# Altium project HouseKeeper_V1.PrjPcb
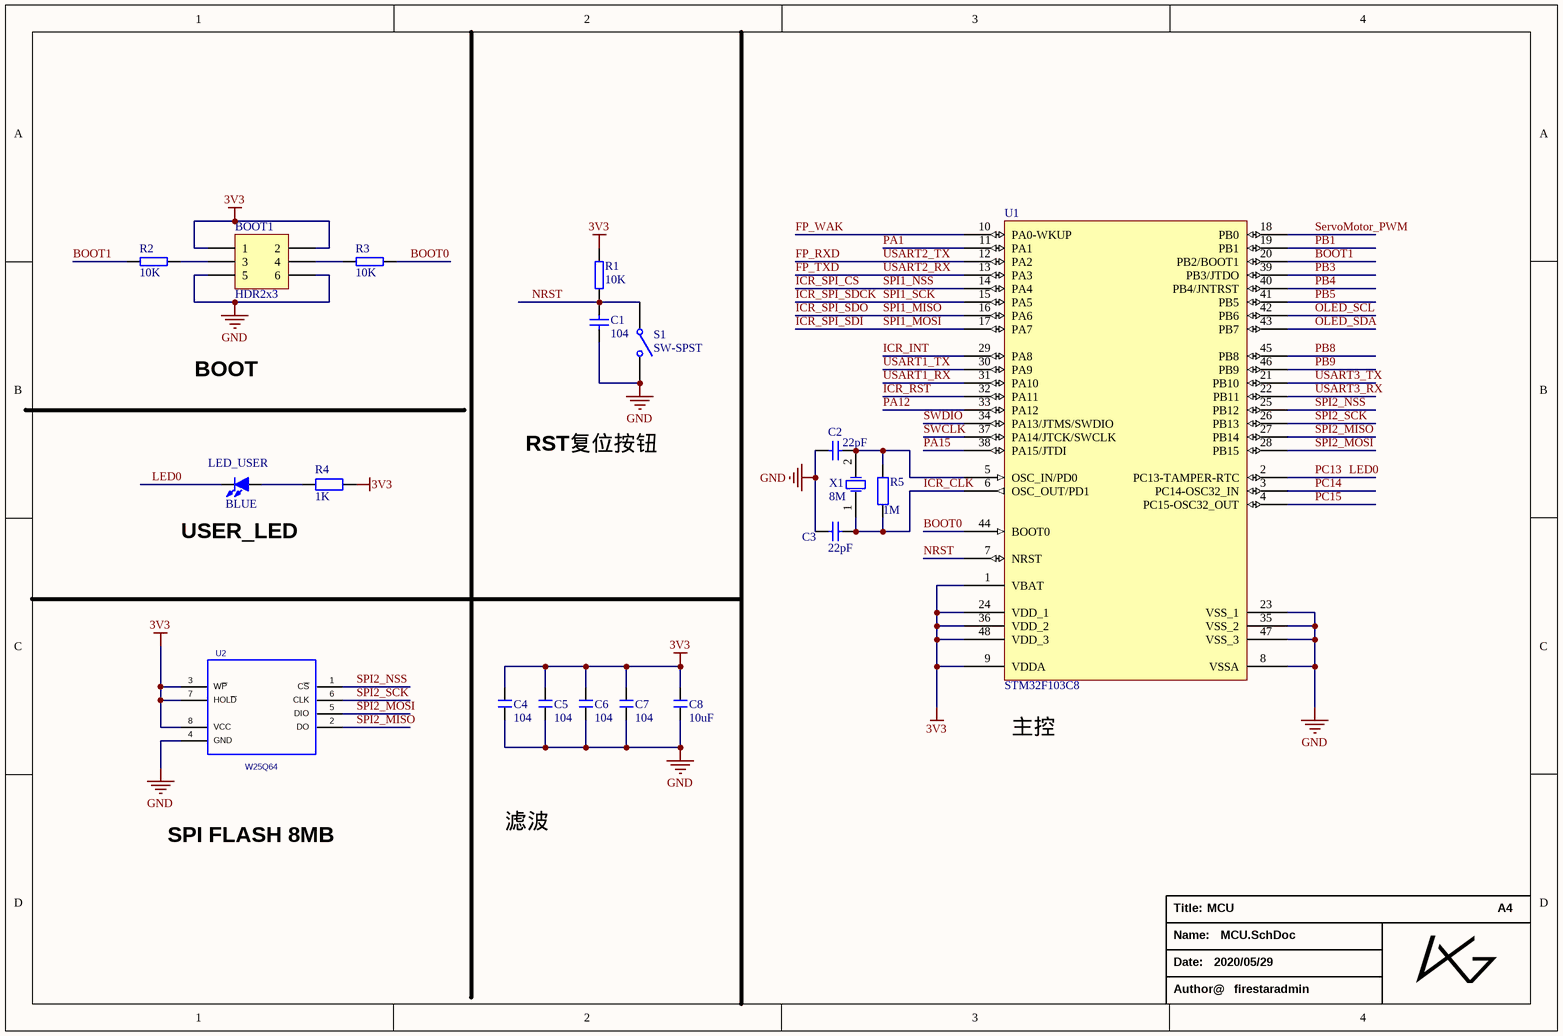
[diagram p0: MCU.SchDoc]
5 sheets, 83 parts. Net scope: global (net labels, ports and power ports of the same name join across sheets).
Board file: V1.PcbDoc
Sheets:
  MCU.SchDoc
  ESP8266EX.SchDoc
  POWER.SchDoc
  Voice.SchDoc
  interface.SchDoc

## Sheet MCU.SchDoc: MCU
size A4; Date: 2020/05/29; SheetNumber: 1

### Parts
BOOT1  HDR2x3  [HDR2.54-LI-2x3P]
C1  104  [C 0603_M]
C2  22pF  [C 0603_M]
C3  22pF  [C 0603_M]
C4  104  [C 0603_M]
C5  104  [C 0603_M]
C6  104  [C 0603_M]
C7  104  [C 0603_M]
C8  10uF  [C 0805_M]
LED_USER  BLUE  [LED 0603B]
R1  10K  [R 0603_M]
R2  10K  [R 0603_M]
R3  10K  [R 0603_M]
R4  1K  [R 0805_M]
R5  1M  [R 0603_M]
S1  SW-SPST  [TSW SMD-3*6*2.5]
U1  STM32F103C8  [LQFP48 7X7_M]
U2  W25Q64  [SOP8W_M]
X1  8M  [OSC 5032-2P]

### Nets
3V3: BOOT1.1 BOOT1.2 C4.2 C5.2 C6.2 C7.2 C8.2 R1.2 R4.2 U1.1(VBAT) U1.9(VDDA) U1.24(VDD_1) U1.36(VDD_2) U1.48(VDD_3) U2.3(W~{P}) U2.7(HOL~{D}) U2.8(VCC)
GND: BOOT1.5 BOOT1.6 C1.2 C2.2 C3.2 C4.1 C5.1 C6.1 C7.1 C8.1 S1.2(NO) U1.8(VSSA) U1.23(VSS_1) U1.35(VSS_2) U1.47(VSS_3) U2.4(GND)
BOOT0: R3.1 U1.44(BOOT0)
BOOT1: R2.2 U1.20(PB2/BOOT1)
FP_RXD: U1.12(PA2)  [also labelled USART2_TX]
FP_TXD: U1.13(PA3)  [also labelled USART2_RX]
FP_WAK: U1.10(PA0-WKUP)
ICR_CLK: C3.1 R5.1 U1.6(OSC_OUT/PD1) X1.1
ICR_INT: U1.29(PA8)
ICR_RST: U1.32(PA11)
ICR_SPI_CS: U1.14(PA4)  [also labelled SPI1_NSS]
ICR_SPI_SDCK: U1.15(PA5)  [also labelled SPI1_SCK]
ICR_SPI_SDI: U1.17(PA7)  [also labelled SPI1_MOSI]
ICR_SPI_SDO: U1.16(PA6)  [also labelled SPI1_MISO]
LED0: LED_USER.2(K) U1.2(PC13-TAMPER-RTC)  [also labelled PC13]
NRST: C1.1 R1.1 S1.1(COMMON) U1.7(NRST)
OLED_SCL: U1.42(PB6)
OLED_SDA: U1.43(PB7)
PA1: U1.11(PA1)
PA12: U1.33(PA12)
PA15: U1.38(PA15/JTDI)
PB1: U1.19(PB1)
PB3: U1.39(PB3/JTDO)
PB4: U1.40(PB4/JNTRST)
PB5: U1.41(PB5)
PB8: U1.45(PB8)
PB9: U1.46(PB9)
PC14: U1.3(PC14-OSC32_IN)
PC15: U1.4(PC15-OSC32_OUT)
ServoMotor_PWM: U1.18(PB0)
SPI2_MISO: U1.27(PB14) U2.2(DO)
SPI2_MOSI: U1.28(PB15) U2.5(DIO)
SPI2_NSS: U1.25(PB12) U2.1(C~{S})
SPI2_SCK: U1.26(PB13) U2.6(CLK)
SWCLK: U1.37(PA14/JTCK/SWCLK)
SWDIO: U1.34(PA13/JTMS/SWDIO)
USART1_RX: U1.31(PA10)
USART1_TX: U1.30(PA9)
USART3_RX: U1.22(PB11)
USART3_TX: U1.21(PB10)
NetBOOT1_3: BOOT1.3 R2.1
NetBOOT1_4: BOOT1.4 R3.2
NetC2_1: C2.1 R5.2 U1.5(OSC_IN/PD0) X1.2
NetLED_USER_1: LED_USER.1(A) R4.1

### Notes on the sheet
- BOOT
- RST复位按钮
- (near LED_USER) USER_LED
- (near U1) 主控
- SPI FLASH 8MB
- 滤波
- Title:
- A4
- Name:
- Date:
- Author@
- firestaradmin

### Library data of the parts
BOOT1 = HDR2x3: Connector
C1 = CAP1: Capacitor; Tolerate: 50V; Value: 100nF; TOL: 10%; ERP: 0103020075; PCB_Layout: Top Layer SMC; Revision: 2012-3-28; Publisher: ZL_A0OFFICE
C2 C3 = CAP1: Capacitor; Tolerate: 50V; Value: 20pF; TOL: 2%; ERP: 0103020090; PCB_Layout: Top Layer SMC; Revision: 2012-3-28; Publisher: ZL_A0OFFICE
C4-C8 = C: 无极性贴片电容; 版权归属: 源创客; BOM名称: 无极性贴片电容; 学习资源: www.ooocke.com
LED_USER = LED-SMD: 贴片LED; 版权归属: 源创客; BOM名称: 贴片LED; 学习资源: www.ooocke.com
R1-R3 = R
R4 R5 = R: 贴片电阻; 版权归属: 源创客; BOM名称: 贴片电阻; 学习资源: www.ooocke.com
S1 = SW-SPST: Single-Pole, Single-Throw Switch
U1 = STM32F103C8: Flaah:64/RAM:20/IO:36; BOM名称: 32位STM单片机; 版权归属: 源创客; 学习资源: www.ooocke.com
U2 = W25Q64: PCB DECAL: SO8WB
X1 = XTAL_SMD: Crystal Oscillator; ERP: 0103040021; Value: 8MHz; TOL: ±20ppm; Tolerate: ROSON -20_+70 20pf; PCB_Layout: Top Layer SMC; Publisher: ZL_A0OFFICE; Revision: 2012-3-28

## Sheet ESP8266EX.SchDoc
size A4; Date: 2020/05/29
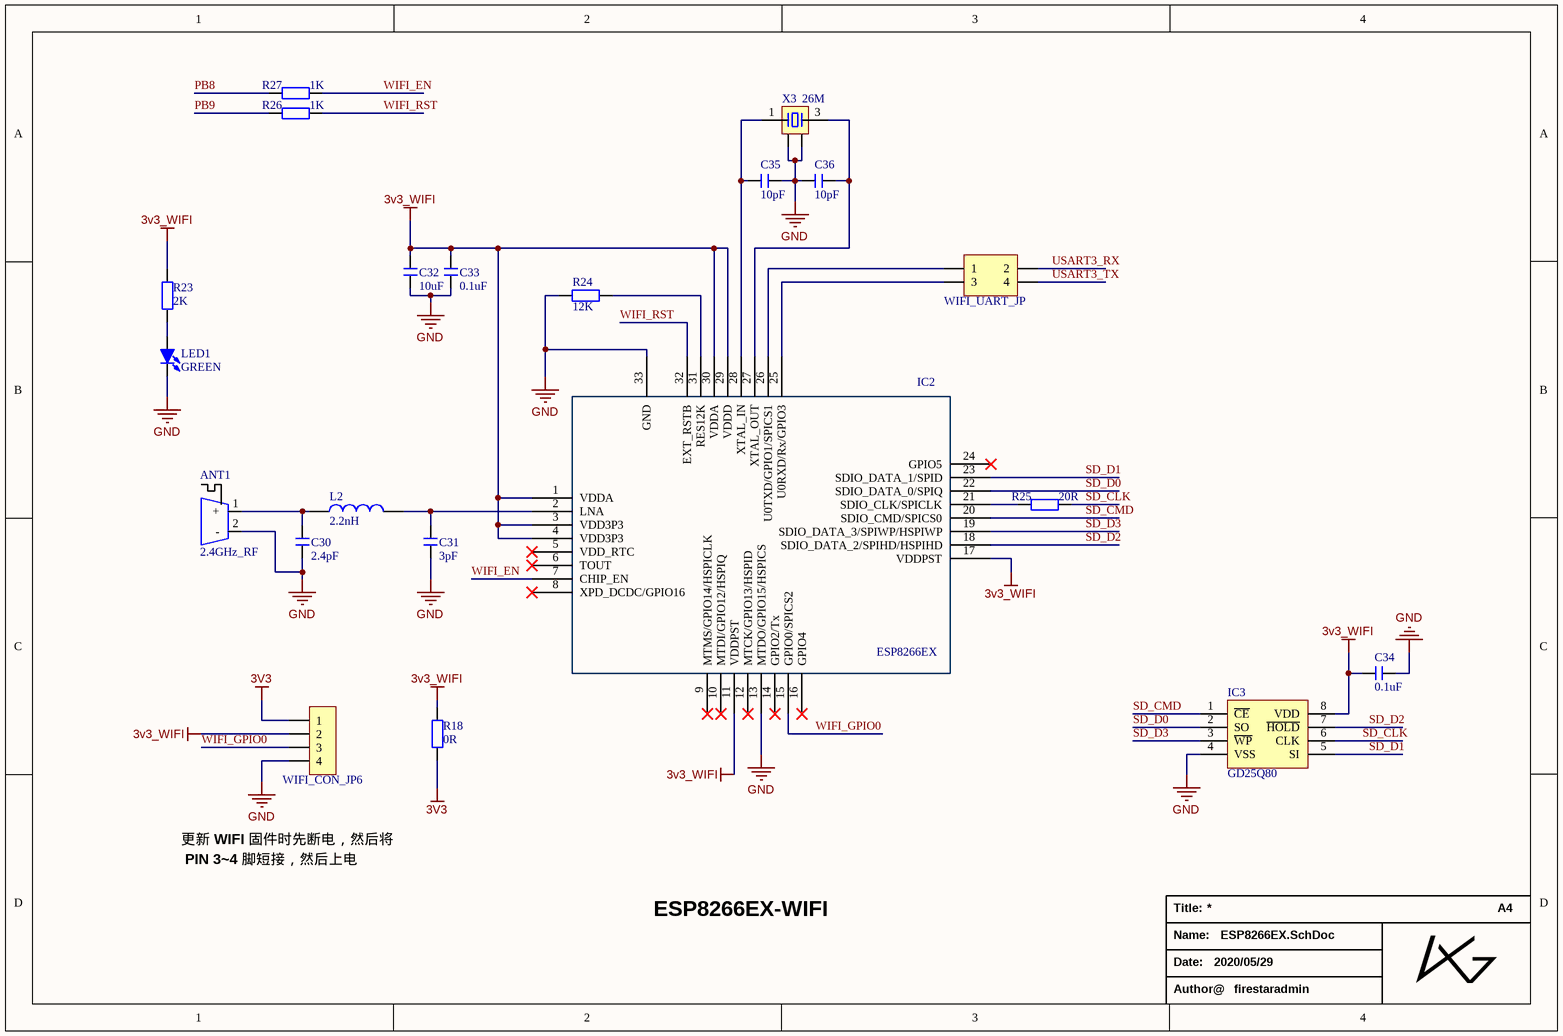
[diagram p1: ESP8266EX.SchDoc]

### Parts
ANT1  2.4GHz_RF  [ANT-F-1-2.4G]
C30  2.4pF  [C 0603_M]
C31  3pF  [C 0603_M]
C32  10uF  [C 0603_M]
C33  0.1uF  [C 0603_M]
C34  0.1uF  [C 0603_M]
C35  10pF  [C 0603_M]
C36  10pF  [C 0603_M]
IC2  ESP8266EX  [QFN32 5x5_M]
IC3  GD25Q80  [SOP8W_N]
L2  2.2nH  [L 0603]
LED1  GREEN  [LED 0603G]
R18  0R  [R 0603_M]
R23  2K  [R 0603_M]
R24  12K  [R 0603_M]
R25  20R  [R 0603_M]
R26  1K  [R 0603_M]
R27  1K  [R 0603_M]
WIFI_CON_JP6  HDR-1X4  [HDR2.54-LI-4P]  (value not drawn)
WIFI_UART_JP  Header2X2  [HDR2.54-LI-2x2P]  (value not drawn)
X3  26M  [OSC 3225-4P]

### Nets
3V3: R18.1 WIFI_CON_JP6.1
3v3_WIFI: C32.1 C33.1 C34.1 IC2.1(VDDA) IC2.3(VDD3P3) IC2.4(VDD3P3) IC2.11(VDDPST) IC2.17(VDDPST) IC2.29(VDDD) IC2.30(VDDA) IC3.8(VDD) R18.2 R23.2 WIFI_CON_JP6.2
GND: ANT1.2(-) C30.2 C31.2 C32.2 C33.2 C34.2 C35.1 C36.2 IC2.13(MTDO/GPIO15/HSPICS) IC2.33(GND) IC3.4(VSS) LED1.2(K) R24.2 WIFI_CON_JP6.4 X3.2 X3.4
PB8: R27.2
PB9: R26.2
SD_CLK: IC3.6(CLK) R25.1
SD_CMD: IC2.20(SDIO_CMD/SPICS0) IC3.1(~{CE})
SD_D0: IC2.22(SDIO_DATA_0/SPIQ) IC3.2(SO)
SD_D1: IC2.23(SDIO_DATA_1/SPID) IC3.5(SI)
SD_D2: IC2.18(SDIO_DATA_2/SPIHD/HSPIHD) IC3.7(~{HOLD})
SD_D3: IC2.19(SDIO_DATA_3/SPIWP/HSPIWP) IC3.3(~{WP})
USART3_RX: WIFI_UART_JP.2
USART3_TX: WIFI_UART_JP.4
WIFI_EN: IC2.7(CHIP_EN) R27.1
WIFI_GPIO0: IC2.15(GPIO0/SPICS2) WIFI_CON_JP6.3
WIFI_RST: IC2.32(EXT_RSTB) R26.1
NetANT1_1: ANT1.1(+) C30.1 L2.1
NetC31_1: C31.1 IC2.2(LNA) L2.2
NetC35_2: C35.2 IC2.28(XTAL_IN) X3.1
NetC36_1: C36.1 IC2.27(XTAL_OUT) X3.3
NetIC2_21: IC2.21(SDIO_CLK/SPICLK) R25.2
NetIC2_25: IC2.25(U0RXD/Rx/GPIO3) WIFI_UART_JP.3
NetIC2_26: IC2.26(U0TXD/GPIO1/SPICS1) WIFI_UART_JP.1
NetIC2_31: IC2.31(RES12K) R24.1
NetLED1_1: LED1.1(A) R23.1

Not connected (* = marked no-connect by the designer): IC2 5(VDD_RTC)* 6(TOUT)* 8(XPD_DCDC/GPIO16)* 9(MTMS/GPIO14/HSPICLK)* 10(MTDI/GPIO12/HSPIQ)* 12(MTCK/GPIO13/HSPID)* 14(GPIO2/Tx)* 16(GPIO4)* 24(GPIO5)*

### Notes on the sheet
- 更新 WIFI 固件时先断电，然后将
- PIN 3~4 脚短接，然后上电
- ESP8266EX-WIFI
- Title:
- A4
- Name:
- Date:
- Author@
- firestaradmin

### Library data of the parts
C30-C36 = C: 无极性贴片电容; 版权归属: 源创客; BOM名称: 无极性贴片电容; 学习资源: www.ooocke.com
IC2 = ESP8266EX: WIFI-芯片; 版权归属: 源创客; BOM名称: WIFI-芯片; 学习资源: www.ooocke.com
IC3 = SST25VFxx: 外置Flash; 版权归属: 源创客; BOM名称: 外置Flash; 学习资源: www.ooocke.com
L2 = L: 小功率贴片电感; 版权归属: 源创客; BOM名称: 小功率贴片电感; 学习资源: www.ooocke.com
LED1 = LED-SMD: 贴片LED; 版权归属: 源创客; BOM名称: 贴片LED; 学习资源: www.ooocke.com
R18 R23-R27 = RES: Resistor
WIFI_CON_JP6 = Header 4: 4P接插件; 版权归属: 源创客; BOM名称: 4P接插件; 学习资源: www.ooocke.com
WIFI_UART_JP = Header 2X2: 2*2P接插件; 版权归属: 源创客; BOM名称: 2*2P接插件; 学习资源: www.ooocke.com
X3 = XTAL-4P: 4脚无源晶振; 版权归属: 源创客; BOM名称: 4脚无源晶振; 学习资源: www.ooocke.com

## Sheet POWER.SchDoc
size A4; Date: 2020/05/29
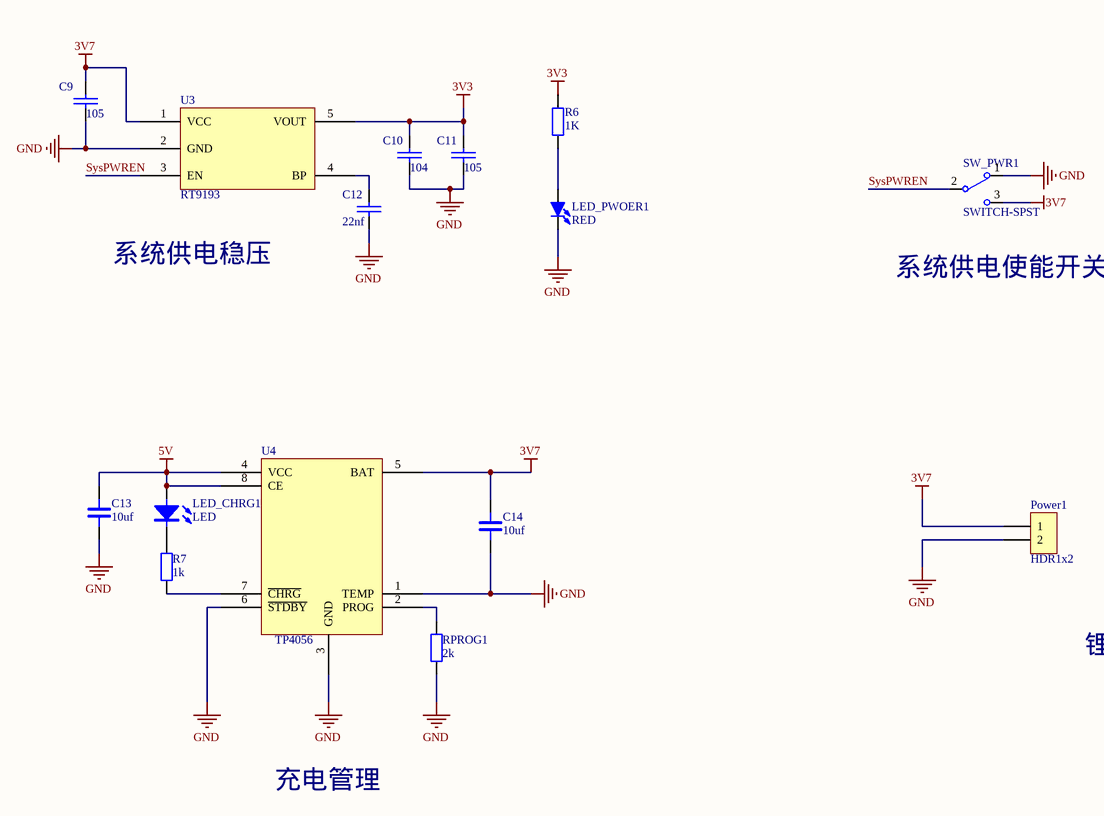
[diagram p2: POWER.SchDoc]

### Parts
C9  105  [C 0603_M]
C10  104  [C 0603_M]
C11  105  [C 0603_M]
C12  22nf  [C 0603_M]
C13  10uf  [C 0805_M]
C14  10uf  [C 0805_M]
LED_CHRG1  LED  [LED 0603G]
LED_PWOER1  RED  [LED 0603R]
Power1  HDR1x2  [XH2.54-LI-2P]
R6  1K  [R 0603_M]
R7  1k  [R 0603_M]
RPROG1  2k  [R 0603_M]
SW_PWR1  SWITCH-SPST  [Switch_3p_2.5mmjianju]
U3  RT9193  [SOT-23-5]
U4  TP4056  [ESOP8]

### Nets
3V3: C10.1 C11.1 R6.2 U3.5(VOUT)
3V7: C9.1 C14.2 Power1.1 SW_PWR1.3 U3.1(VCC) U4.5(BAT)
5V: C13.2 LED_CHRG1.1(A) U4.4(VCC) U4.8(CE)
GND: C9.2 C10.2 C11.2 C12.2 C13.1 C14.1 LED_PWOER1.2(K) Power1.2 RPROG1.1 SW_PWR1.1 U3.2(GND) U4.1(TEMP) U4.3(GND) U4.6(~{STDBY})
SysPWREN: SW_PWR1.2 U3.3(EN)
NetC12_1: C12.1 U3.4(BP)
NetLED_CHRG1_2: LED_CHRG1.2(C) R7.2
NetLED_PWOER1_1: LED_PWOER1.1(A) R6.1
NetR7_1: R7.1 U4.7(~{CHRG})
NetRPROG1_2: RPROG1.2 U4.2(PROG)

### Notes on the sheet
- 系统供电稳压
- (near SW_PWR1) 系统供电使能开关
- 锂电池接口
- 充电管理
- Title:
- A4
- Name:
- Date:
- Author@
- firestaradmin

### Library data of the parts
C9-C14 = CAP: Capacitor
LED_PWOER1 = LED-SMD: 贴片LED; 版权归属: 源创客; BOM名称: 贴片LED; 学习资源: www.ooocke.com
Power1 = HDR1x2: Connector
R6 = R: 贴片电阻; 版权归属: 源创客; BOM名称: 贴片电阻; 学习资源: www.ooocke.com
R7 RPROG1 = RES: Resistor
SW_PWR1 = SWITCH-SPST: Switch

## Sheet Voice.SchDoc
size A4; Date: 2020/05/29
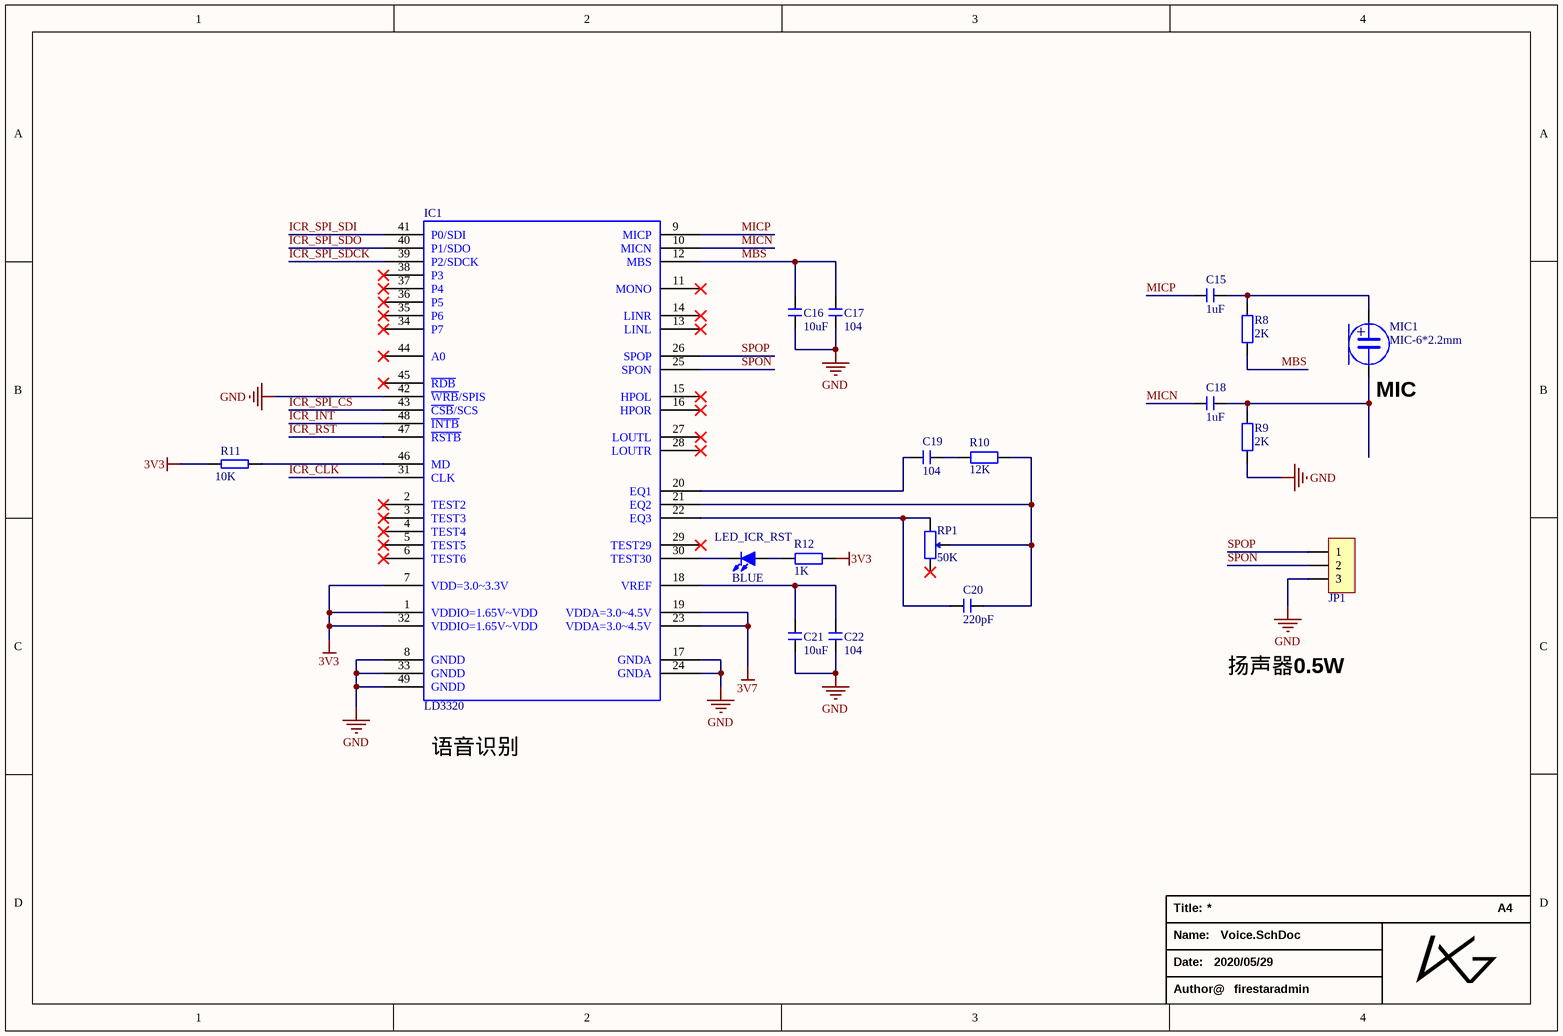
[diagram p3: Voice.SchDoc]

### Parts
C15  1uF  [C 0603_M]
C16  10uF  [C 0805_M]
C17  104  [C 0603_M]
C18  1uF  [C 0603_M]
C19  104  [C 0603_M]
C20  220pF  [C 0603_M]
C21  10uF  [C 0805_M]
C22  104  [C 0603_M]
IC1  LD3320  [QFN48 7X7_M]
JP1  HDR-1X3  [HDR2.54-LI-3P]  (value not drawn)
LED_ICR_RST  BLUE  [LED 0603B]
MIC1  MIC-6*2.2mm  [MIC-6*2.2MM]
R8  2K  [R 0805_M]
R9  2K  [R 0805_M]
R10  12K  [R 0805_M]
R11  10K  [R 0603_M]
R12  1K  [R 0805_M]
RP1  50K  [3306W]

### Nets
3V3: IC1.1(VDDIO=1.65V~VDD) IC1.7(VDD=3.0~3.3V) IC1.32(VDDIO=1.65V~VDD) R11.1 R12.2
3V7: IC1.19(VDDA=3.0~4.5V) IC1.23(VDDA=3.0~4.5V)
GND: C16.1 C17.1 C21.1 C22.1 IC1.8(GNDD) IC1.17(GNDA) IC1.24(GNDA) IC1.33(GNDD) IC1.42(~{WRB}/SPIS) IC1.49(GNDD) JP1.3 R9.1
ICR_CLK: IC1.31(CLK)
ICR_INT: IC1.48(~{INTB})
ICR_RST: IC1.47(~{RSTB})
ICR_SPI_CS: IC1.43(~{CSB}/SCS)
ICR_SPI_SDCK: IC1.39(P2/SDCK)
ICR_SPI_SDI: IC1.41(P0/SDI)
ICR_SPI_SDO: IC1.40(P1/SDO)
MBS: C16.2 C17.2 IC1.12(MBS) R8.1
MICN: C18.2 IC1.10(MICN)
MICP: C15.2 IC1.9(MICP)
SPON: IC1.25(SPON) JP1.2
SPOP: IC1.26(SPOP) JP1.1
NetC15_1: C15.1 MIC1.1 R8.2
NetC18_1: C18.1 MIC1.2 R9.2
NetC19_1: C19.1 R10.1
NetC19_2: C19.2 IC1.20(EQ1)
NetC20_1: C20.1 IC1.21(EQ2) R10.2 RP1.2
NetC20_2: C20.2 IC1.22(EQ3) RP1.1
NetC21_2: C21.2 C22.2 IC1.18(VREF)
NetIC1_30: IC1.30(TEST30) LED_ICR_RST.2(K)
NetIC1_46: IC1.46(MD) R11.2
NetLED_ICR_RST_1: LED_ICR_RST.1(A) R12.1

Not connected (* = marked no-connect by the designer): IC1 2(TEST2)* 3(TEST3)* 4(TEST4)* 5(TEST5)* 6(TEST6)* 11(MONO)* 13(LINL)* 14(LINR)* 15(HPOL)* 16(HPOR)* 27(LOUTL)* 28(LOUTR)* 29(TEST29)* 34(P7)* 35(P6)* 36(P5)* 37(P4)* 38(P3)* 44(A0)* 45(~{RDB})*; RP1 3*

### Notes on the sheet
- (near MIC1) MIC
- 扬声器0.5W
- (near IC1) 语音识别
- Title:
- A4
- Name:
- Date:
- Author@
- firestaradmin
- (in symbol MIC1) +

### Library data of the parts
C15-C22 = C: 无极性贴片电容; 版权归属: 源创客; BOM名称: 无极性贴片电容; 学习资源: www.ooocke.com
IC1 = LD3320: LD3320 芯片是一款“ 语音识别”专用芯片，由 ICRoute 公司设计生产。该芯 / 片集成了语音识别处理器和一些外部电路，包括 AD、DA 转换器、麦克风接口、 / 声音输出接口等。本芯片在设计上注重节能与高效，不需要外接任何的辅助芯片 / 如 Flash、RAM 等，直接集成在现有的产品中即可以实现语音识别/声控/人机对 / 话功能。并且，识别的关键词语列表是可以任意动态编辑的。
JP1 = Header 3: 3P接插件; 版权归属: 源创客; BOM名称: 3P接插件; 学习资源: www.ooocke.com
LED_ICR_RST = LED-SMD: 贴片LED; 版权归属: 源创客; BOM名称: 贴片LED; 学习资源: www.ooocke.com
MIC1 = MIC1: 电容麦克风; 版权归属: 源创客; BOM名称: 电容麦克风; 学习资源: www.ooocke.com
R8-R10 R12 = R: 贴片电阻; 版权归属: 源创客; BOM名称: 贴片电阻; 学习资源: www.ooocke.com
R11 = R
RP1 = RP-ID: 插件单联电位器; BOM名称: 插件电位器; 版权归属: 源创客; 学习资源: www.ooocke.com

## Sheet interface.SchDoc
size A4; Date: 2020/05/29
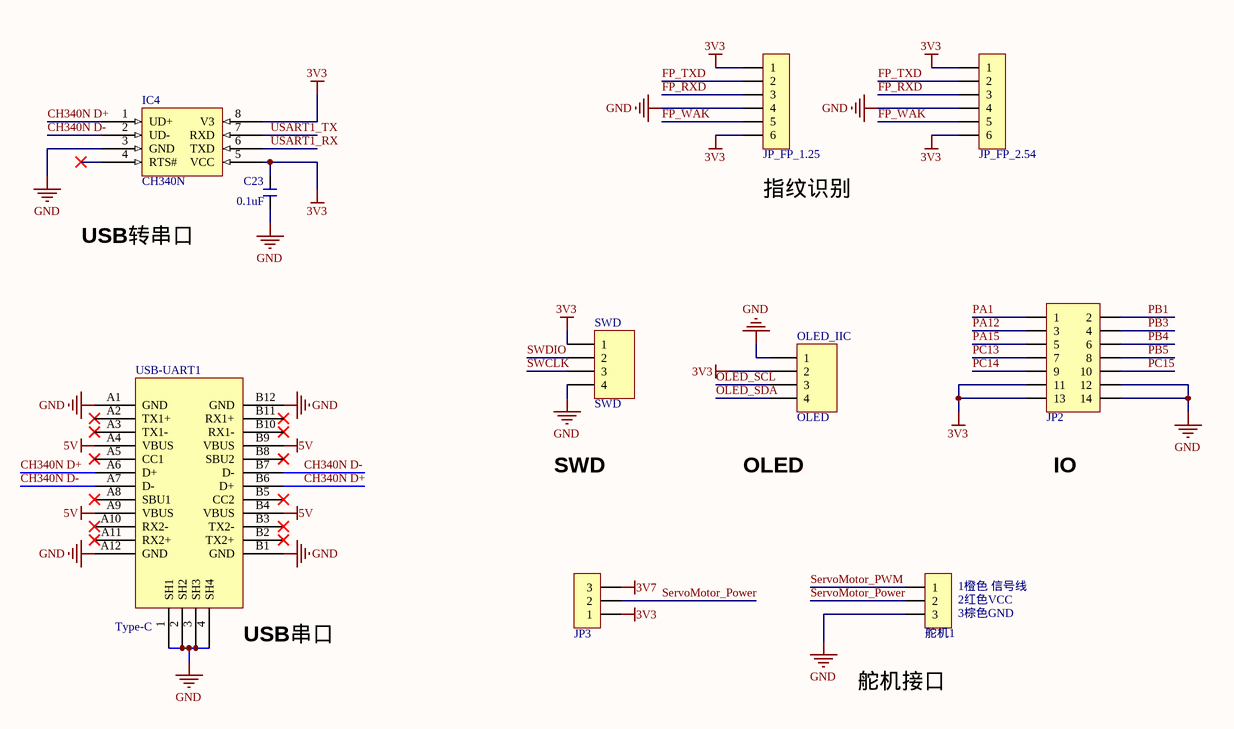
[diagram p4: interface.SchDoc]

### Parts
C23  0.1uF  [C 0603_M]
IC4  CH340N  [SOP8_N]
JP2  Header 2X7  [HDR2.54-LI-2x7P]  (value not drawn)
JP3  HDR-1X3  [HDR2.54-LI-3P]  (value not drawn)
JP_FP_1.25  HDR-1X6  [MX 1.25-WS-6P]  (value not drawn)
JP_FP_2.54  HDR-1X6  [HDR2.54-LI-2x3P]  (value not drawn)
OLED_IIC  OLED  [HDR2.54-LI-4P]
SWD  SWD  [HDR2.54-LI-4P]
USB-UART1  Type-C  [TYPE-C]
舵机1  HDR-1X3  [HDR2.54-LI-3P]  (value not drawn)

### Nets
3V3: C23.2 IC4.5(VCC) IC4.8(V3) JP2.11 JP2.13 JP3.1 JP_FP_1.25.1 JP_FP_1.25.6 JP_FP_2.54.1 JP_FP_2.54.6 OLED_IIC.2 SWD.1
3V7: JP3.3
5V: USB-UART1.A4(VBUS) USB-UART1.A9(VBUS) USB-UART1.B4(VBUS) USB-UART1.B9(VBUS)
GND: C23.1 IC4.3(GND) JP2.12 JP2.14 JP_FP_1.25.4 JP_FP_2.54.4 OLED_IIC.1 SWD.4 USB-UART1.1(SH1) USB-UART1.2(SH2) USB-UART1.3(SH3) USB-UART1.4(SH4) USB-UART1.A1(GND) USB-UART1.A12(GND) USB-UART1.B1(GND) USB-UART1.B12(GND) 舵机1.3
CH340N D+: IC4.1(UD+) USB-UART1.A6(D+) USB-UART1.B6(D+)
CH340N D-: IC4.2(UD-) USB-UART1.A7(D-) USB-UART1.B7(D-)
FP_RXD: JP_FP_1.25.3 JP_FP_2.54.3
FP_TXD: JP_FP_1.25.2 JP_FP_2.54.2
FP_WAK: JP_FP_1.25.5 JP_FP_2.54.5
OLED_SCL: OLED_IIC.3
OLED_SDA: OLED_IIC.4
PA1: JP2.1
PA12: JP2.3
PA15: JP2.5
PB1: JP2.2
PB3: JP2.4
PB4: JP2.6
PB5: JP2.8
PC13: JP2.7  [project net LED0]
PC14: JP2.9
PC15: JP2.10
ServoMotor_Power: JP3.2 舵机1.2
ServoMotor_PWM: 舵机1.1
SWCLK: SWD.3
SWDIO: SWD.2
USART1_RX: IC4.6(TXD)
USART1_TX: IC4.7(RXD)

Not connected (* = marked no-connect by the designer): IC4 4(RTS#)*; USB-UART1 A2(TX1+)* A3(TX1-)* A5(CC1)* A8(SBU1)* A10(RX2-)* A11(RX2+)* B2(TX2+)* B3(TX2-)* B5(CC2)* B8(SBU2)* B10(RX1-)* B11(RX1+)*

### Notes on the sheet
- USB转串口
- (near JP_FP_1.25) 指纹识别
- SWD
- OLED
- IO
- (near USB-UART1) USB串口
- (near 舵机1) 1橙色 信号线
- (near 舵机1) 2红色VCC
- (near 舵机1) 3棕色GND
- 舵机接口
- Title:
- A4
- Name:
- Date:
- Author@
- firestaradmin

### Library data of the parts
C23 = C: 无极性贴片电容; 版权归属: 源创客; BOM名称: 无极性贴片电容; 学习资源: www.ooocke.com
IC4 = CH340N: USB 转串口芯片 CH330/CH340N
JP2 = Header 7X2: 7*2P接插件; 版权归属: 源创客; BOM名称: 7*2P接插件; 学习资源: www.ooocke.com
JP3 舵机1 = Header 3: 3P接插件; 版权归属: 源创客; BOM名称: 3P接插件; 学习资源: www.ooocke.com
JP_FP_1.25 JP_FP_2.54 = Header 6: 6P接插件; 版权归属: 源创客; BOM名称: 6P接插件; 学习资源: www.ooocke.com
OLED_IIC SWD = Header 4: Header, 4-Pin; LatestRevisionDate: 17-Jul-2002; LatestRevisionNote: Re-released for DXP Platform.; Publisher: Altium Limited

## Nets that join several sheets
3V3: MCU (17 pins), ESP8266EX (R18.1 WIFI_CON_JP6.1), POWER (C10.1 C11.1 R6.2 U3.5), Voice (5 pins), interface (12 pins)
3V7: POWER (6 pins), Voice (IC1.19 IC1.23), interface (JP3.3)
5V: POWER (C13.2 LED_CHRG1.1 U4.4 U4.8), interface (USB-UART1.A4 USB-UART1.A9 USB-UART1.B4 USB-UART1.B9)
GND: MCU (16 pins), ESP8266EX (16 pins), POWER (14 pins), Voice (12 pins), interface (17 pins)
FP_RXD: MCU (U1.12), interface (JP_FP_1.25.3 JP_FP_2.54.3)
FP_TXD: MCU (U1.13), interface (JP_FP_1.25.2 JP_FP_2.54.2)
FP_WAK: MCU (U1.10), interface (JP_FP_1.25.5 JP_FP_2.54.5)
ICR_CLK: MCU (C3.1 R5.1 U1.6 X1.1), Voice (IC1.31)
ICR_INT: MCU (U1.29), Voice (IC1.48)
ICR_RST: MCU (U1.32), Voice (IC1.47)
ICR_SPI_CS: MCU (U1.14), Voice (IC1.43)
ICR_SPI_SDCK: MCU (U1.15), Voice (IC1.39)
ICR_SPI_SDI: MCU (U1.17), Voice (IC1.41)
ICR_SPI_SDO: MCU (U1.16), Voice (IC1.40)
LED0: MCU (LED_USER.2 U1.2), interface (JP2.7)
OLED_SCL: MCU (U1.42), interface (OLED_IIC.3)
OLED_SDA: MCU (U1.43), interface (OLED_IIC.4)
PA1: MCU (U1.11), interface (JP2.1)
PA12: MCU (U1.33), interface (JP2.3)
PA15: MCU (U1.38), interface (JP2.5)
PB1: MCU (U1.19), interface (JP2.2)
PB3: MCU (U1.39), interface (JP2.4)
PB4: MCU (U1.40), interface (JP2.6)
PB5: MCU (U1.41), interface (JP2.8)
PB8: MCU (U1.45), ESP8266EX (R27.2)
PB9: MCU (U1.46), ESP8266EX (R26.2)
PC14: MCU (U1.3), interface (JP2.9)
PC15: MCU (U1.4), interface (JP2.10)
ServoMotor_PWM: MCU (U1.18), interface (舵机1.1)
SWCLK: MCU (U1.37), interface (SWD.3)
SWDIO: MCU (U1.34), interface (SWD.2)
USART1_RX: MCU (U1.31), interface (IC4.6)
USART1_TX: MCU (U1.30), interface (IC4.7)
USART3_RX: MCU (U1.22), ESP8266EX (WIFI_UART_JP.2)
USART3_TX: MCU (U1.21), ESP8266EX (WIFI_UART_JP.4)